# Altium schematic sheet 5V_Supply_Alt_1.SchDoc
size OrCAD A
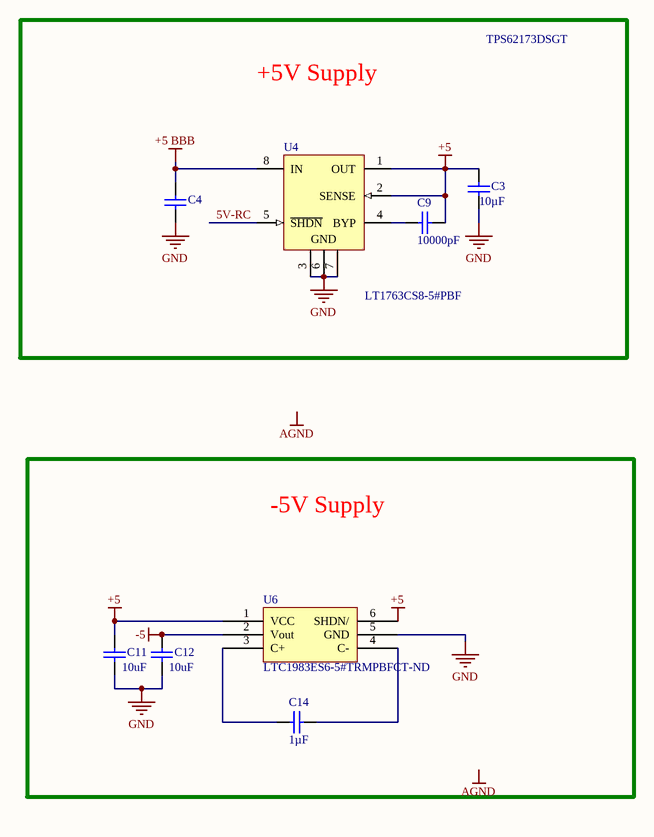
[diagram p0: 5V_Supply_Alt_1.SchDoc]

## Parts
C3  Capacitance: 10µF  [CAPC1206(3216)130_N]  (hidden comment: CAP CER 1UF 50V X7R 1210)
C4  1uF  [CAPC1206(3216)130_N]  (value not drawn)
C9  Capacitance: 10000pF  [CAPC1206(3216)130_N]  (hidden comment: CAP CER 1UF 50V X7R 1210)
C11  Capacitance: 10uF  [CAPC1206(3216)130_N]  (hidden comment: CAP CER 10UF 6.3V X5R 1206)
C12  Capacitance: 10uF  [CAPC1206(3216)130_N]  (hidden comment: CAP CER 10UF 6.3V X5R 1206)
C14  Capacitance: 1µF  [CAPC1206(3216)130_N]  (hidden comment: CAP CER 1UF 10V X5R 0805)
U4  LT1763CS8-5#PBF  [LT-S8-8_M]
U6  Supplier Part Number 1: LTC1983ES6-5#TRMPBFCT-ND  [SOT95P323X100-6N]  (hidden comment: LTC1983ES6-5#TRMPBF)

## Blocks framed on the sheet
+5V Supply: C3 C4 C9 U4
-5V Supply: C11 C12 C14 U6

## Nets
+5: C3.2 C9.1 C11.2 U4.1(OUT) U4.2(SENSE) U6.1(VCC) U6.6(SHDN/)
+5 BBB: C4.2 U4.8(IN)
-5: C12.2 U6.2(Vout)
GND: C3.1 C4.1 C11.1 C12.1 U4.3(GND) U4.6(GND) U4.7(GND) U6.5(GND)
5V-RC: U4.5(~{SHDN})
NetC9_2: C9.2 U4.4(BYP)
NetC14_1: C14.1 U6.4(C-)
NetC14_2: C14.2 U6.3(C+)

## Notes on the sheet
- TPS62173DSGT
- Labels drawn without touching a wire or pin: AGND
- Title
- Size:
- Date:
- Orcad A
- Number:
- Time:
- Revision:
- Sheet
- of
- ZLS Corporation
- 7801 North Lamar Blvd.
- Suite E-184
- Austin, Texas 78752  USA
- (512) 453-0288
- File:

## Library data of the parts
C3 C9 = CMP-1037-04913-1: Manufacturer: Murata Electronics North America; Manufacturer Part Number: GRM32RR71H105KA01L; Tolerance: ±10%; Supplier 1: Digi-Key; Supplier Part Number 1: 490-1863-6-ND; RoHS: RoHS Compliant; Category: Capacitors; Stock 1: 66890; Pricing 1: 1=0.35, 10=0.242, 100=0.1449, 500=0.10868 (USD); Packaging: Digi-Reel®; Part Status: Active; Voltage - Rated: 50V; Temperature Coefficient: X7R; Operating Temperature: -55°C ~ 125°C; Features: -; Ratings: -; Applications: General Purpose; Mounting Type: Surface Mount, MLCC; Package / Case: 1210 (3225 Metric); Size / Dimension: 0.126" L x 0.098" W (3.20mm x 2.50mm); Height - Seated (Max): -; Thickness (Max): 0.079" (2.00mm); Lead Spacing: -; Lead Style: -; ComponentLink1URL: http://search.murata.co.jp/Ceramy/image/img/A01X/G101/ENG/GRM32RR71H105KA01-01.pdf; ComponentLink1Description: http://search.murata.co.jp/Ceramy/image/img/A01X/G101/ENG/GRM32RR71H105KA01-01.pdf
C4 = CMP-1037-04913-1
C11 C12 = CMP-1037-04913-1: Manufacturer: Taiyo Yuden; Manufacturer Part Number: JMK316BJ106ML-T; Tolerance: ±20%; Notification: Current market demand for these product types have resulted in fluctuating and extending lead times. Lead times may differ.; Supplier 1: Digi-Key; Supplier Part Number 1: 587-5447-1-ND; RoHS: RoHS Compliant; Category: Capacitors; Stock 1: 5600; Pricing 1: 1=0.24, 10=0.161, 100=0.0817, 500=0.05592, 1000=0.04946 (USD); Packaging: Cut Tape (CT); Part Status: Active; Voltage - Rated: 6.3V; Temperature Coefficient: X5R; Operating Temperature: -55°C ~ 85°C; Features: -; Ratings: -; Applications: SMPS Filtering; Failure Rate: -; Mounting Type: Surface Mount, MLCC; Package / Case: 1206 (3216 Metric); Size / Dimension: 0.126" L x 0.063" W (3.20mm x 1.60mm); Height - Seated (Max): -; Thickness (Max): 0.071" (1.80mm); Lead Spacing: -; Lead Style: -; ComponentLink1URL: http://ds.yuden.co.jp/TYCOMPAS/ut/detail.do?productNo=JMK316BJ106ML-T&fileName=JMK316BJ106ML-T_SS&mode=specSheetDownload; ComponentLink1Description: http://ds.yuden.co.jp/TYCOMPAS/ut/detail.do?productNo=JMK316BJ106ML-T&fileName=JMK316BJ106ML-T_SS&mode=specSheetDownload
C14 = CMP-1037-04913-1: Manufacturer: Taiyo Yuden; Manufacturer Part Number: LMK212BJ105MD-T; Tolerance: ±20%; Notification: Current market demand for these product types have resulted in fluctuating and extending lead times. Lead times may differ.; Supplier 1: Digi-Key; Supplier Part Number 1: 587-4918-1-ND; RoHS: RoHS Compliant; Category: Capacitors; Stock 1: 2994; Pricing 1: 1=0.17, 10=0.121, 100=0.0567, 500=0.03976, 1000=0.03291 (USD); Packaging: Cut Tape (CT); Part Status: Active; Voltage - Rated: 10V; Temperature Coefficient: X5R; Operating Temperature: -55°C ~ 85°C; Features: -; Ratings: -; Applications: SMPS Filtering; Failure Rate: -; Mounting Type: Surface Mount, MLCC; Package / Case: 0805 (2012 Metric); Size / Dimension: 0.079" L x 0.049" W (2.00mm x 1.25mm); Height - Seated (Max): -; Thickness (Max): 0.037" (0.95mm); Lead Spacing: -; Lead Style: -; ComponentLink1URL: http://ds.yuden.co.jp/TYCOMPAS/ut/detail.do?productNo=LMK212BJ105MD-T&fileName=LMK212BJ105MD-T_SS&mode=specSheetDownload; ComponentLink1Description: http://ds.yuden.co.jp/TYCOMPAS/ut/detail.do?productNo=LMK212BJ105MD-T&fileName=LMK212BJ105MD-T_SS&mode=specSheetDownload
U4 = CMP-0476-01685-1: 500 mA, Low Noise, LDO Micropower Regulator, 1.8 to 20 V Vin, 5 V Vout, 8-pin SOIC (S8-8), -40 to 125 degC, Pb-Free; Manufacturer: Linear Technology; Output Voltage: 5 V; Vin Min(V): 1.8; Discrete Pass Element: no; Number of Outputs: 1; Dropout Voltage(V): 0.3; Vin Max(V): 20; PSRR(dB): 65; Iout(mA): 500; Isupply(mA): 0.03; Mounting Technology: Surface Mount; ComponentLink3Description: Package Specification; PartNumber: LT1763CS8-5#PBF; PackageDescription: 8-Pin Plastic Small Outline (Narrow .150 Inch), Body 4.9 x 3.9 mm, Pitch 1.27 mm; DatasheetVersion: Rev. G; ComponentLink2URL: http://cds.linear.com/docs/en/datasheet/1763fg.pdf; PackageReference: S8-8; ComponentLink1URL: http://www.linear.com/; ComponentLink2Description: Datasheet; ComponentLink1Description: Manufacturer URL; PackageVersion: Rev. G, 03/2012; Shutdown Current(uA): 1; ComponentLink3URL: http://cds.linear.com/docs/en/packaging/05081610_G_SO8.pdf; RoHS: TRUE; Noise(uV): 20
U6 = LTC1983ES6-5#TRMPBF: Manufacturer: Linear Technology/Analog Devices; Function: Step-Down; Output Configuration: Negative; Topology: Charge Pump; Output Type: Fixed; Number of Outputs: 1; Voltage - Input (Min): 2.3V; Voltage - Input (Max): 5.5V; Voltage - Output (Min/Fixed): -5V; Current - Output: 100mA; Frequency - Switching: 900kHz; Synchronous Rectifier: No; Supplier 1: Digi-Key; Manufacturer Part Number: LTC1983ES6-5#TRMPBF; RoHS: RoHS Compliant; Category: Integrated Circuits (ICs); Stock 1: 17516; Pricing 1: 1=4.36, 25=3.8952, 100=2.3256, 250=2.1318 (USD); Packaging: Cut Tape (CT); Part Status: Active; Voltage - Output (Max): -; Operating Temperature: -40°C ~ 85°C (TA); Mounting Type: Surface Mount; Package / Case: SOT-23-6 Thin, TSOT-23-6; Supplier Device Package: TSOT-23-6; Base Part Number: LTC1983-5; ComponentLink1URL: http://www.linear.com/docs/2135; ComponentLink1Description: http://www.linear.com/docs/2135